# Altium schematic sheet Power.SchDoc
size A
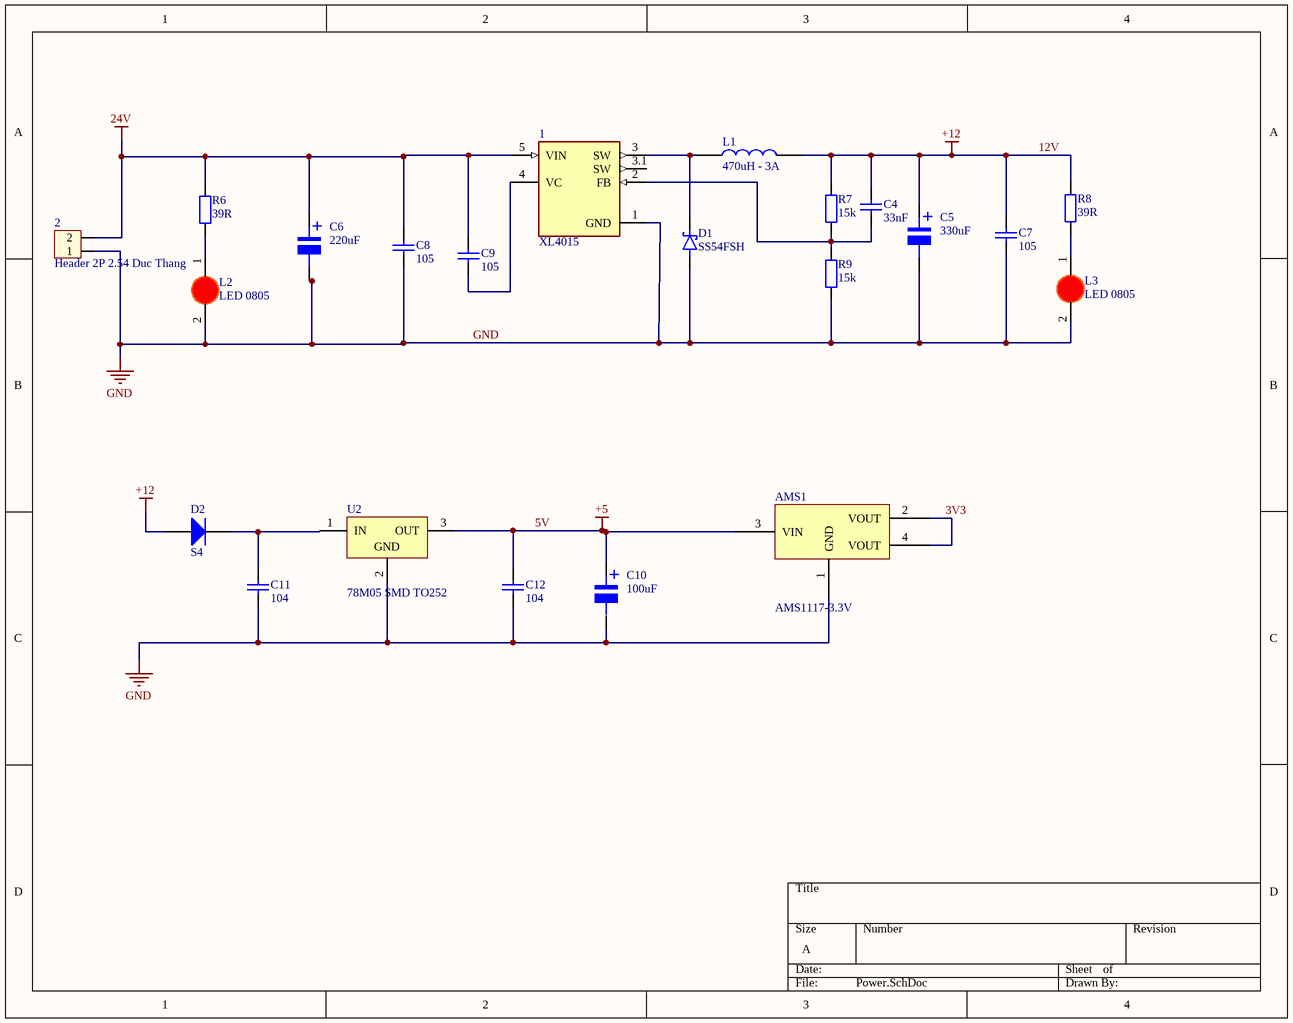
[diagram p0: Power.SchDoc]

## Parts
1  XL4015  [CONV_XL4015]
2  Header 2P 2.54 Duc Thang  [KF2-5.08]
AMS1  AMS1117-3.3V  [SOT223]
C4  33nF  [tu 0402]
C5  330uF  [tu nhom 10 (g)]
C6  220uF  [tu nhom 10 (g)]
C7  105  [tu 0603]
C8  105  [tu 0603]
C9  105  [tu 0603]
C10  100uF  [tu nhom 6.3 (d)]
C11  104  [tu 1206]
C12  104  [tu 1206]
D1  SS54FSH  [SODFL4725X110N]
D2  S4  [DIODE SOD-123]
L1  470uH - 3A  [CUON CAM 100uH3A]
L2  LED 0805  [LED-0805-Red]
L3  LED 0805  [LED-0805-Red]
R6  39R  [tro smd 0603]
R7  15k  [tro smd 0603]
R8  39R  [tro smd 0603]
R9  15k  [tro smd 0603]
U2  78M05 SMD TO252  [TO252]

## Nets
5V: AMS1.3(VIN) C10.1 C12.1 U2.3(OUT)  [also labelled +5]
12V: C4.1 C5.1 C7.1 D2.1(A) L1.2 R7.2 R8.2  [also labelled +12]
24V: 1.5(VIN) 2.2 C6.1 C8.2 C9.2 R6.2
GND: 1.1(GND) 2.1 AMS1.1(GND) C5.2 C6.2 C7.2 C8.1 C10.2 C11.2 C12.2 D1.A L2.2(K) L3.2(K) R9.1 U2.2(GND)
3V3: AMS1.2(VOUT) AMS1.4(VOUT)
Net1_2: 1.2(FB) C4.2 R7.1 R9.2
Net1_3: 1.3(SW) D1.C(K) L1.1
Net1_4: 1.4(VC) C9.1
NetC11_1: C11.1 D2.2(K) U2.1(IN)
NetL2_1: L2.1(A) R6.1
NetL3_1: L3.1(A) R8.1

Not connected (* = marked no-connect by the designer): 1 3.1(SW)

## Notes on the sheet
- (in symbol Tu Nhom 100uF 25V) +
- (in symbol Tu Nhom 220uF 50V) +
- (in symbol Tu Nhom 330uF 50V) +

## Library data of the parts
1 = XL4015: 5A 180KHz 36V Buck DC to DC Converter; Price: None; MP: XL4015; Value: *; Availability: Unavailable; Package: None
2 = Header 2P 2.54 Duc Thang: Cắm; Ten_Linh_Kien: Header 2P XH2.54-2P Đực Thẳng; Don_Vi: Con; Ma_Hang: MH001283; Chung_Loai: Cắm
AMS1 = AMS1117 SMD: Dán; Value: AMS1117-3.3V SOT223; Don_Vi: Con; Ma_Hang: MH000596; Ghi_Chu: *; Kieu_Chan: *; Chung_Loai: Dán
C4 = Tu 0402 33nF 10V: Dán; Don_Vi: Con; So_Chan: 2; Ten_Linh_Kien: Tụ 0402 33nF X7R 10V GRM155R71A333KA01D; Ma_Hang: MH007853; Chung_Loai: Dán; Kieu_Chan: *
C5 = Tu Nhom 330uF 50V: Dán; Don_Vi: Con; So_Chan: 2; Ten_Linh_Kien: Tụ Nhôm 330uF 50V 10x10.2MM; Ma_Hang: MH002225; Chung_Loai: Dán; Kieu_Chan: *
C6 = Tu Nhom 220uF 50V: Dán; Don_Vi: Con; So_Chan: 2; Ten_Linh_Kien: Tụ Nhôm 220uF 50V 10x10.2MM; Ma_Hang: MH002228; Chung_Loai: Dán; Kieu_Chan: *
C7 = Tu 0603 105 16V 20%: Dán; Don_Vi: Con; So_Chan: 2; Ten_Linh_Kien: Tụ 0603 105-1uF 20% 16V; Ma_Hang: MH004574; Chung_Loai: Dán; Kieu_Chan: *
C8 C9 = Tu 0603 105 50V 10%: Dán; Don_Vi: Con; So_Chan: 2; Ten_Linh_Kien: Tụ 0603 105-1uF 50V 10%; Ma_Hang: MH004569; Chung_Loai: Dán; Kieu_Chan: *
C10 = Tu Nhom 100uF 25V: Dán; Don_Vi: Con; So_Chan: 2; Ten_Linh_Kien: Tụ Nhôm 100uF 25V 6x7MM; Ma_Hang: MH002222; Chung_Loai: Dán; Kieu_Chan: *
C11 C12 = Tu 1206 104 50V 20%: Dán; Don_Vi: Con; So_Chan: 2; Ten_Linh_Kien: Tụ 1206 104-0.1uF 20% 50V; Ma_Hang: MH004544; Chung_Loai: Dán; Kieu_Chan: *
D1 = SS54FSH: 5A, 40V, Schottky Rectifier; MF: Taiwan Semiconductor; Value: *; SnapEDA_Link: https://www.snapeda.com/parts/SS54FSH/Taiwan+Semiconductor/view-part/?ref=snap; MP: SS54FSH; Check_prices: https://www.snapeda.com/parts/SS54FSH/Taiwan+Semiconductor/view-part/?ref=eda; Availability: In Stock; Price: None; Package: SOD-128-2 Taiwan Semiconductor
D2 = Diode S4: Dán; Ten_Linh_Kien: Diode S4 SOD123 ( 1N5819 SOD123); Ma_Hang: MH005519; Don_Vi: Con; Ghi_Chu: *; Chung_Loai: Dán; Kieu_Chan: *
L1 = CUON CAM 470uH DIP: Cắm; Don_Vi: Con; Ma_Hang: MH002232; Ten_Linh_Kien: Cuộn Cảm 470uH 3A 8x10MM; Ghi_Chu: *; Kieu_Chan: *; Chung_Loai: Cắm
L2 L3 = LED 0805 Do: Dán; Don_Vi: Con; Ma_Hang: MH000897; Ten_Linh_Kien: LED 0805 Màu Đỏ (Red); Ghi_Chu: *; Kieu_Chan: *; Chung_Loai: Dán
R6 R8 = Tro 0603 5% 39R: Dán; Don_Vi: Con; So_Chan: 2; Ten_Linh_Kien: Trở 0603 5% 39R; Ma_Hang: MH008714; Chung_Loai: Dán; Kieu_Chan: *
R7 R9 = Tro 0603 5% 15k: Dán; So_Chan: 2; Don_Vi: Con; Ten_Linh_Kien: Trở 0603 5% 15k; Ma_Hang: MH004575; Chung_Loai: Dán; Kieu_Chan: *
U2 = 78M05 SMD TO252: Dán; Don_Vi: Con; Ten_Linh_Kien: 78M05 TO252; Ma_Hang: MH001917; Ghi_Chu: *; Kieu_Chan: *; Chung_Loai: Dán